# Altium schematic sheet DC unit.SchDoc
size 420 x 297 mm; Address1: Address1; Address2: Address2; Address3: Address3; Address4: Address4; DocumentNumber: АБВГ.123456.001 Э3; SheetNumber: 2; Scale: 1:1; DocumentType: Схема электрическая принципиальная; FirstReferrence: АБВГ.123456.001
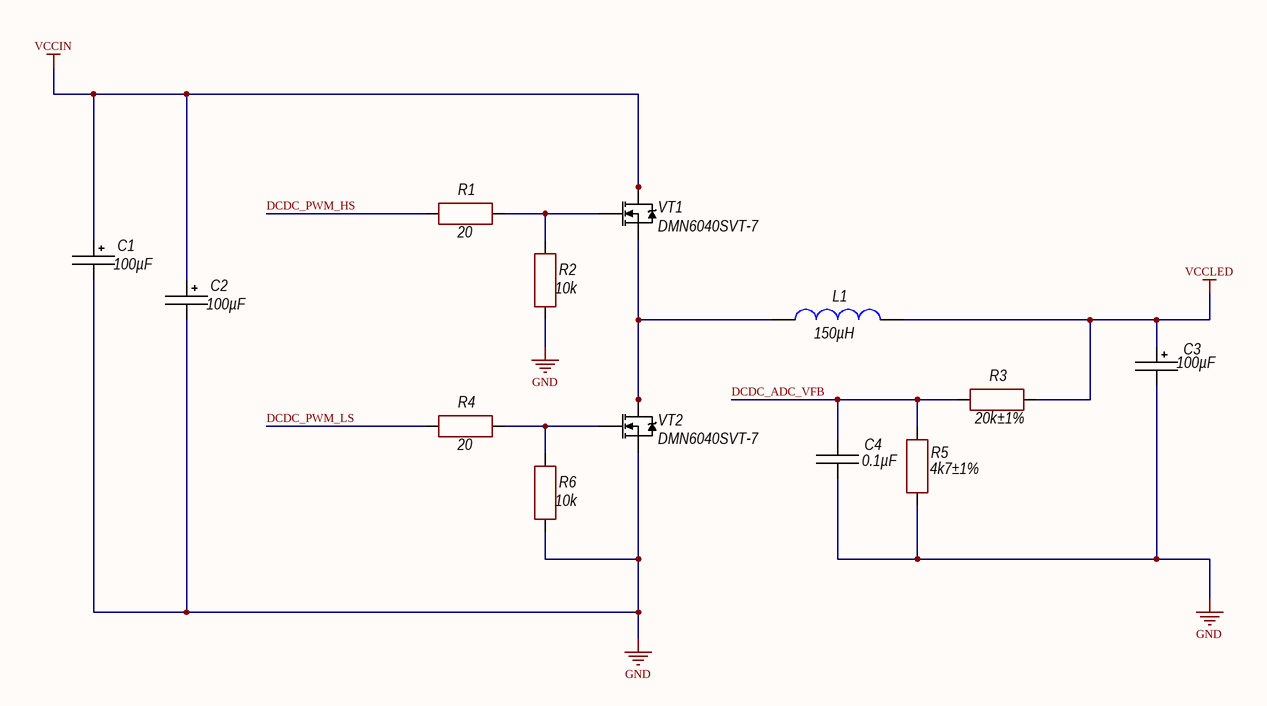
[diagram p0: DC unit.SchDoc]

## Parts
C1  100µF  [D8C3.2H12]
C2  100µF  [D8C3.2H12]
C3  100µF  [TANTAL_D]
C4  0.1µF  [CH0603C]
L1  150µH  [IND: CDRH127]
R1  20  [CH0603R]
R2  10k  [CH0603R]
R3  20k  ComponentKind: ±1%  [CH0603R]
R4  20  [CH0603R]
R5  4k7  ComponentKind: ±1%  [CH0603R]
R6  10k  [CH0603R]
VT1  DMN6040SVT-7  [TSOT23-6]
VT2  DMN6040SVT-7  [TSOT23-6]

## Nets
GND: C1.2 C2.2 C3.2 C4.2 R2.1 R5.1 R6.1 VT2.4(S)
VCCIN: C1.1 C2.1 VT1.1(D) VT1.2(D) VT1.5(D) VT1.6(D)
VCCLED: C3.1 L1.1 R3.2
DCDC_ADC_VFB: C4.1 R3.1 R5.2
DCDC_PWM_HS: R1.1
DCDC_PWM_LS: R4.1
NetL1_2: L1.2 VT1.4(S) VT2.1(D) VT2.2(D) VT2.5(D) VT2.6(D)
NetR1_2: R1.2 R2.2 VT1.3(G)
NetR4_2: R4.2 R6.2 VT2.3(G)

## Notes on the sheet
- Подп. и дата
- Инв. № дубл.
- Взам. инв. №
- Инв. № подл.
- Изм.
- Лист
- № докум.
- Подп.
- Дата
- 2.106-A3
- Копировал
- Формат А3

## Library data of the parts
C1 C2 = AlumCap: Manufacturer: *; Model: *; HelpURL: *; ComponentKind: *; Value: 100µF
C3 = TantalCap: Manufacturer: Vishay Intertechnology Inc.; Model: TPSD107K020R0085; HelpURL: https://www.terraelectronica.ru/product/579425; ComponentKind: 20V; Value: 100µF
C4 = Capacitor: Manufacturer: *; Model: *; HelpURL: *; ComponentKind: *; Value: 0.1µF
L1 = Inductor: Manufacturer: Sumida Electric; Model: CDRH127/LDNP-390MC; HelpURL: https://www.terraelectronica.ru/product/231334; ComponentKind: 3.5А; Value: 150µH
R1-R6 = Resistor: Manufacturer: *; Model: *; HelpURL: *
  R1 R4: ComponentKind: *; Value: 20
  R2 R6: ComponentKind: *; Value: 10k
  R3: Value: 20k
  R5: Value: 4k7
VT1 VT2 = DMN6040SVT-7: Mosfet; Manufacturer: Diodes Incorporated; Model: DMN6040SVT-7; ComponentKind: 60V 5A; HelpURL: https://www.diodes.com/assets/Datasheets/DMN6040SVT.pdf